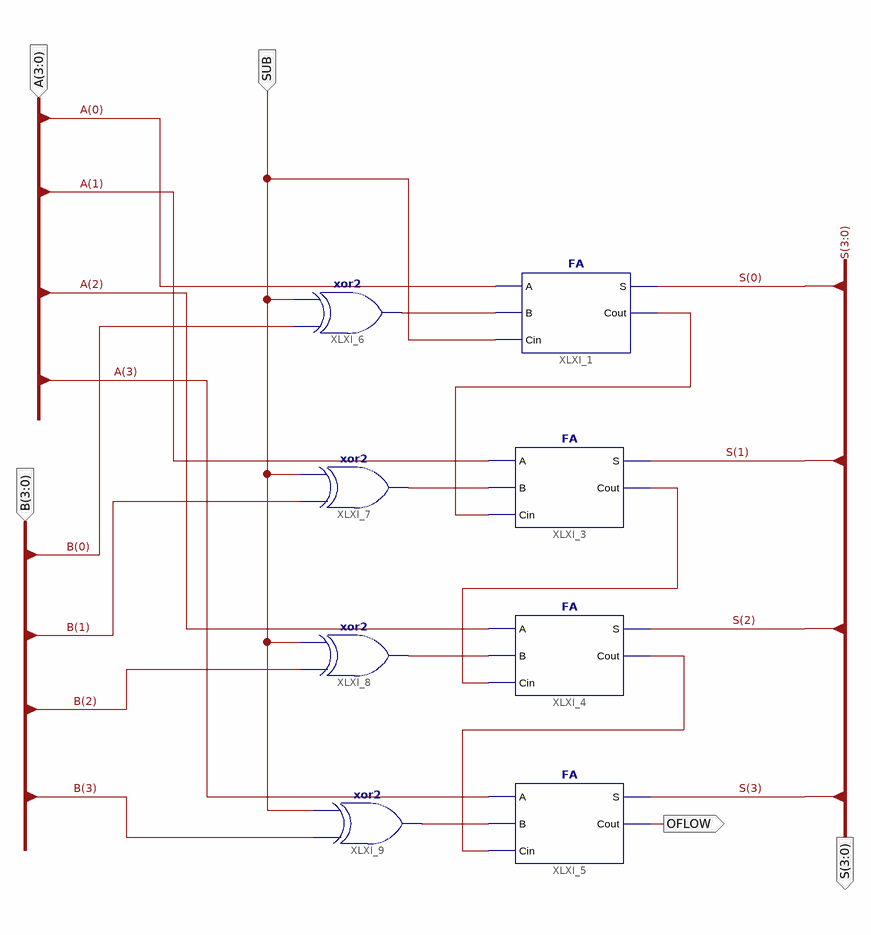
[diagram p0: schematic sheet 1]
// Xilinx ISE schematic RCA.sch (spartan3e) as structural Verilog: 8 symbols, 5 ports
module RCA (
  input  SUB,
  input  [3:0] B,
  input  [3:0] A,
  output [3:0] S,
  output OFLOW
);

  wire XLXN_1, XLXN_2, XLXN_5, XLXN_6, XLXN_10, XLXN_11, XLXN_12;

  FA XLXI_1 (.A(A[0]), .B(XLXN_5), .Cin(SUB), .Cout(XLXN_10), .S(S[0]));
  FA XLXI_3 (.A(A[1]), .B(XLXN_2), .Cin(XLXN_10), .Cout(XLXN_11), .S(S[1]));
  FA XLXI_4 (.A(A[2]), .B(XLXN_1), .Cin(XLXN_11), .Cout(XLXN_12), .S(S[2]));
  FA XLXI_5 (.A(A[3]), .B(XLXN_6), .Cin(XLXN_12), .Cout(OFLOW), .S(S[3]));
  xor XLXI_6 (XLXN_5, B[0], SUB);
  xor XLXI_7 (XLXN_2, B[1], SUB);
  xor XLXI_8 (XLXN_1, B[2], SUB);
  xor XLXI_9 (XLXN_6, B[3], SUB);
endmodule
